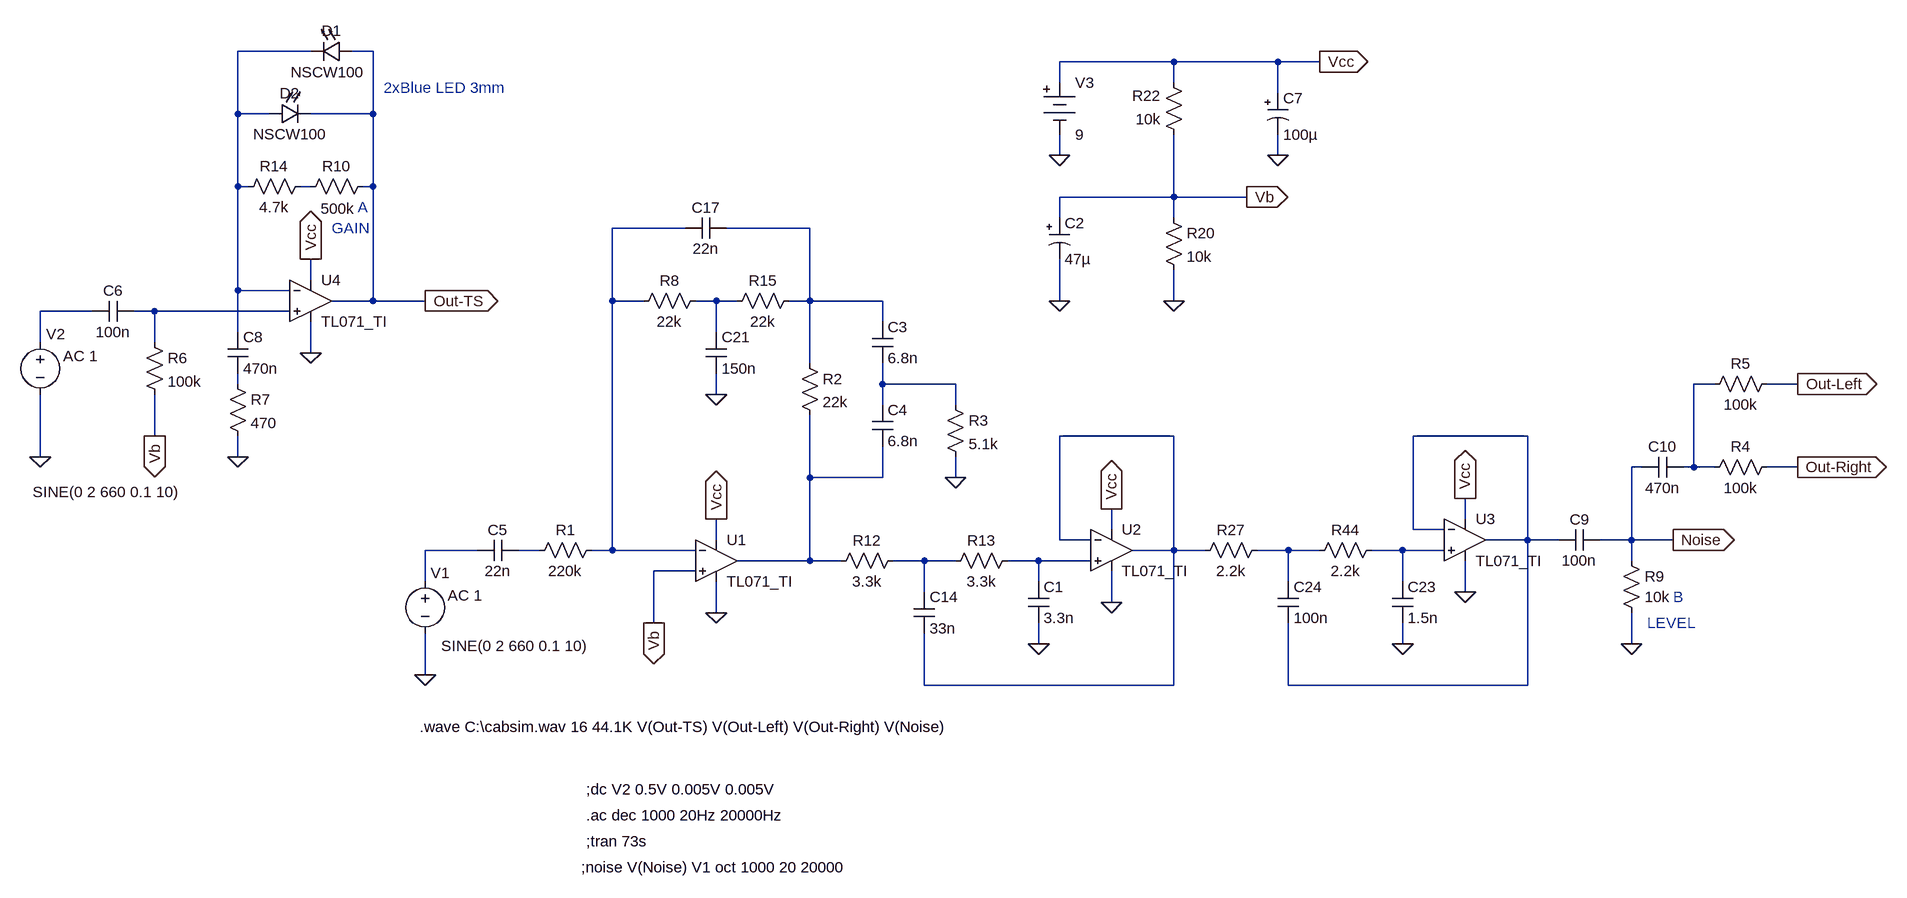
[diagram p0: schematic MB 4x12 V30 Cabinet Simulator.asc]
MB 4x12 V30 Cabinet Simulator.asc, the LTspice schematic file:
Version 4
SHEET 1 2020 1684
WIRE -4080 -624 -4192 -624
WIRE -3984 -624 -4016 -624
WIRE -2752 -608 -2928 -608
WIRE -2592 -608 -2752 -608
WIRE -2528 -608 -2592 -608
WIRE -2928 -576 -2928 -608
WIRE -2752 -576 -2752 -608
WIRE -2592 -560 -2592 -608
WIRE -4192 -528 -4192 -624
WIRE -4144 -528 -4192 -528
WIRE -3984 -528 -3984 -624
WIRE -3984 -528 -4080 -528
WIRE -2928 -464 -2928 -496
WIRE -2592 -464 -2592 -496
WIRE -4192 -416 -4192 -528
WIRE -4176 -416 -4192 -416
WIRE -4080 -416 -4096 -416
WIRE -3984 -416 -3984 -528
WIRE -3984 -416 -4000 -416
WIRE -2752 -400 -2752 -496
WIRE -2752 -400 -2928 -400
WIRE -2640 -400 -2752 -400
WIRE -2928 -368 -2928 -400
WIRE -2752 -368 -2752 -400
WIRE -3504 -352 -3616 -352
WIRE -3312 -352 -3440 -352
WIRE -4080 -272 -4080 -304
WIRE -4192 -256 -4192 -416
WIRE -4112 -256 -4192 -256
WIRE -3984 -240 -3984 -416
WIRE -3984 -240 -4048 -240
WIRE -3904 -240 -3984 -240
WIRE -3616 -240 -3616 -352
WIRE -3568 -240 -3616 -240
WIRE -3456 -240 -3488 -240
WIRE -3424 -240 -3456 -240
WIRE -3312 -240 -3312 -352
WIRE -3312 -240 -3344 -240
WIRE -3200 -240 -3312 -240
WIRE -2928 -240 -2928 -304
WIRE -2752 -240 -2752 -288
WIRE -4416 -224 -4496 -224
WIRE -4320 -224 -4352 -224
WIRE -4112 -224 -4320 -224
WIRE -3200 -208 -3200 -240
WIRE -4192 -192 -4192 -256
WIRE -3456 -192 -3456 -240
WIRE -4496 -176 -4496 -224
WIRE -4320 -176 -4320 -224
WIRE -4080 -160 -4080 -208
WIRE -3312 -144 -3312 -240
WIRE -4192 -112 -4192 -128
WIRE -3200 -112 -3200 -144
WIRE -3088 -112 -3200 -112
WIRE -1920 -112 -1952 -112
WIRE -1792 -112 -1840 -112
WIRE -3456 -96 -3456 -128
WIRE -3200 -80 -3200 -112
WIRE -3088 -80 -3088 -112
WIRE -4320 -32 -4320 -96
WIRE -2752 -32 -2928 -32
WIRE -2208 -32 -2384 -32
WIRE -4496 0 -4496 -96
WIRE -4192 0 -4192 -32
WIRE -2032 16 -2048 16
WIRE -1952 16 -1952 -112
WIRE -1952 16 -1968 16
WIRE -1920 16 -1952 16
WIRE -1792 16 -1840 16
WIRE -3312 32 -3312 -64
WIRE -3200 32 -3200 -16
WIRE -3200 32 -3312 32
WIRE -3088 32 -3088 0
WIRE -2304 96 -2304 64
WIRE -2848 112 -2848 80
WIRE -2384 112 -2384 -32
WIRE -2336 112 -2384 112
WIRE -3456 128 -3456 96
WIRE -2928 128 -2928 -32
WIRE -2880 128 -2928 128
WIRE -2208 128 -2208 -32
WIRE -2208 128 -2272 128
WIRE -2160 128 -2208 128
WIRE -2048 128 -2048 16
WIRE -2048 128 -2096 128
WIRE -1984 128 -2048 128
WIRE -3824 144 -3904 144
WIRE -3728 144 -3760 144
WIRE -3616 144 -3616 -240
WIRE -3616 144 -3648 144
WIRE -3488 144 -3616 144
WIRE -2752 144 -2752 -32
WIRE -2752 144 -2816 144
WIRE -2704 144 -2752 144
WIRE -2576 144 -2624 144
WIRE -2528 144 -2576 144
WIRE -2400 144 -2448 144
WIRE -2336 144 -2400 144
WIRE -3312 160 -3312 32
WIRE -3312 160 -3424 160
WIRE -3264 160 -3312 160
WIRE -3136 160 -3184 160
WIRE -3088 160 -3136 160
WIRE -2960 160 -3008 160
WIRE -2880 160 -2960 160
WIRE -2048 160 -2048 128
WIRE -3488 176 -3552 176
WIRE -3904 192 -3904 144
WIRE -2960 192 -2960 160
WIRE -2576 192 -2576 144
WIRE -2400 192 -2400 144
WIRE -3136 208 -3136 160
WIRE -2304 208 -2304 160
WIRE -2848 224 -2848 176
WIRE -3456 240 -3456 192
WIRE -3552 256 -3552 176
WIRE -2960 288 -2960 256
WIRE -2400 288 -2400 256
WIRE -2048 288 -2048 240
WIRE -3904 336 -3904 272
WIRE -3136 352 -3136 272
WIRE -2752 352 -2752 144
WIRE -2752 352 -3136 352
WIRE -2576 352 -2576 256
WIRE -2208 352 -2208 128
WIRE -2208 352 -2576 352
FLAG -2928 -464 0
FLAG -2752 -240 0
FLAG -2640 -400 Vb
IOPIN -2640 -400 Out
FLAG -2528 -608 Vcc
IOPIN -2528 -608 Out
FLAG -2400 288 0
FLAG -2304 208 0
FLAG -2304 64 Vcc
IOPIN -2304 64 Out
FLAG -3456 240 0
FLAG -3456 96 Vcc
IOPIN -3456 96 Out
FLAG -3552 256 Vb
IOPIN -3552 256 Out
FLAG -2848 80 Vcc
IOPIN -2848 80 Out
FLAG -2848 224 0
FLAG -2048 288 0
FLAG -2592 -464 0
FLAG -3456 -96 0
FLAG -2928 -240 0
FLAG -2960 288 0
FLAG -1984 128 Noise
IOPIN -1984 128 Out
FLAG -3904 336 0
FLAG -3088 32 0
FLAG -1792 -112 Out-Left
IOPIN -1792 -112 Out
FLAG -1792 16 Out-Right
IOPIN -1792 16 Out
FLAG -4080 -160 0
FLAG -4080 -304 Vcc
IOPIN -4080 -304 Out
FLAG -4192 0 0
FLAG -4320 -32 Vb
IOPIN -4320 -32 Out
FLAG -4496 0 0
FLAG -3904 -240 Out-TS
IOPIN -3904 -240 Out
SYMBOL res -2768 -384 R0
SYMATTR InstName R20
SYMATTR Value 10k
SYMBOL res -2736 -480 R180
WINDOW 0 36 76 Left 2
WINDOW 3 36 40 Left 2
SYMATTR InstName R22
SYMATTR Value 10k
SYMBOL Misc\\battery -2928 -592 R0
WINDOW 123 0 0 Left 2
WINDOW 39 0 0 Left 2
SYMATTR InstName V3
SYMATTR Value 9
SYMBOL polcap -2944 -368 R0
WINDOW 3 24 64 Left 2
SYMATTR Value 47µ
SYMATTR InstName C2
SYMATTR Description Capacitor
SYMATTR Type cap
SYMATTR SpiceLine V=25 Irms=60m Rser=2.4 Lser=0
SYMBOL res -2608 128 R90
WINDOW 0 0 56 VBottom 2
WINDOW 3 32 56 VTop 2
SYMATTR InstName R27
SYMATTR Value 2.2k
SYMBOL cap -2416 192 R0
SYMATTR InstName C23
SYMATTR Value 1.5n
SYMBOL res -2432 128 R90
WINDOW 0 0 56 VBottom 2
WINDOW 3 32 56 VTop 2
SYMATTR InstName R44
SYMATTR Value 2.2k
SYMBOL cap -2592 192 R0
SYMATTR InstName C24
SYMATTR Value 100n
SYMBOL cap -3760 128 R90
WINDOW 0 0 32 VBottom 2
WINDOW 3 32 32 VTop 2
SYMATTR InstName C5
SYMATTR Value 22n
SYMATTR SpiceLine V=16 Irms=0 Rser=0.007 Lser=0
SYMBOL res -3168 144 R90
WINDOW 0 0 56 VBottom 2
WINDOW 3 32 56 VTop 2
SYMATTR InstName R12
SYMATTR Value 3.3k
SYMBOL res -2992 144 R90
WINDOW 0 0 56 VBottom 2
WINDOW 3 32 56 VTop 2
SYMATTR InstName R13
SYMATTR Value 3.3k
SYMBOL cap -3152 208 R0
SYMATTR InstName C14
SYMATTR Value 33n
SYMBOL cap -3440 -368 R90
WINDOW 0 0 32 VBottom 2
WINDOW 3 32 32 VTop 2
SYMATTR InstName C17
SYMATTR Value 22n
SYMBOL res -2064 144 R0
WINDOW 3 36 72 Left 2
SYMATTR Value 10k
SYMATTR InstName R9
SYMBOL polcap -2608 -560 R0
WINDOW 3 24 64 Left 2
SYMATTR Value 100µ
SYMATTR InstName C7
SYMATTR Description Capacitor
SYMATTR Type cap
SYMATTR SpiceLine V=2.5 Irms=1.1 Rser=0.07 Lser=0
SYMBOL res -3472 -256 R90
WINDOW 0 0 56 VBottom 2
WINDOW 3 32 56 VTop 2
SYMATTR InstName R8
SYMATTR Value 22k
SYMBOL res -3328 -256 R90
WINDOW 0 0 56 VBottom 2
WINDOW 3 32 56 VTop 2
SYMATTR InstName R15
SYMATTR Value 22k
SYMBOL cap -3472 -192 R0
SYMATTR InstName C21
SYMATTR Value 150n
SYMATTR SpiceLine V=10 Irms=0 Rser=0.009 Lser=0
SYMBOL cap -2096 112 R90
WINDOW 0 0 32 VBottom 2
WINDOW 3 32 32 VTop 2
SYMATTR InstName C9
SYMATTR Value 100n
SYMBOL EXTRA\\AudioOpamp\\TI\\TL071_TI -3456 160 R0
SYMATTR InstName U1
SYMBOL EXTRA\\AudioOpamp\\TI\\TL071_TI -2848 144 R0
SYMATTR InstName U2
SYMBOL EXTRA\\AudioOpamp\\TI\\TL071_TI -2304 128 R0
SYMATTR InstName U3
SYMBOL res -3632 128 R90
WINDOW 0 0 56 VBottom 2
WINDOW 3 32 56 VTop 2
SYMATTR InstName R1
SYMATTR Value 220k
SYMBOL cap -2976 192 R0
SYMATTR InstName C1
SYMATTR Value 3.3n
SYMBOL voltage -3904 176 R0
WINDOW 123 35 37 Left 2
WINDOW 39 0 0 Left 2
WINDOW 3 25 115 Left 2
WINDOW 0 9 3 Left 2
SYMATTR Value2 AC 1
SYMATTR Value SINE(0 2 660 0.1 10)
SYMATTR InstName V1
SYMBOL res -3328 -160 R0
SYMATTR InstName R2
SYMATTR Value 22k
SYMBOL cap -3216 -208 R0
SYMATTR InstName C3
SYMATTR Value 6.8n
SYMBOL cap -3216 -80 R0
SYMATTR InstName C4
SYMATTR Value 6.8n
SYMBOL res -3104 -96 R0
SYMATTR InstName R3
SYMATTR Value 5.1k
SYMBOL res -1824 0 R90
WINDOW 0 0 56 VBottom 2
WINDOW 3 32 56 VTop 2
SYMATTR InstName R4
SYMATTR Value 100k
SYMBOL res -1824 -128 R90
WINDOW 0 0 56 VBottom 2
WINDOW 3 32 56 VTop 2
SYMATTR InstName R5
SYMATTR Value 100k
SYMBOL cap -4352 -240 R90
WINDOW 0 0 32 VBottom 2
WINDOW 3 32 32 VTop 2
SYMATTR InstName C6
SYMATTR Value 100n
SYMATTR SpiceLine V=16 Irms=0 Rser=0.007 Lser=0
SYMBOL res -4336 -192 R0
SYMATTR InstName R6
SYMATTR Value 100k
SYMBOL EXTRA\\AudioOpamp\\TI\\TL071_TI -4080 -240 R0
SYMATTR InstName U4
SYMBOL res -4208 -128 R0
SYMATTR InstName R7
SYMATTR Value 470
SYMBOL res -3984 -432 R90
WINDOW 0 0 56 VBottom 2
WINDOW 3 34 54 VTop 2
SYMATTR InstName R10
SYMATTR Value 500k
SYMBOL cap -4208 -192 R0
SYMATTR InstName C8
SYMATTR Value 470n
SYMATTR SpiceLine V=16 Irms=0 Rser=0.007 Lser=0
SYMBOL LED -4016 -640 R90
WINDOW 0 0 32 VBottom 2
WINDOW 3 32 38 VTop 2
SYMATTR InstName D1
SYMATTR Value NSCW100
SYMATTR Description Diode
SYMATTR Type diode
SYMBOL LED -4144 -544 M90
WINDOW 0 0 32 VBottom 2
WINDOW 3 32 32 VTop 2
SYMATTR InstName D2
SYMATTR Value NSCW100
SYMATTR Description Diode
SYMATTR Type diode
SYMBOL res -4080 -432 R90
WINDOW 0 0 56 VBottom 2
WINDOW 3 32 56 VTop 2
SYMATTR InstName R14
SYMATTR Value 4.7k
SYMBOL voltage -4496 -192 R0
WINDOW 123 35 37 Left 2
WINDOW 39 0 0 Left 2
WINDOW 3 -12 246 Left 2
WINDOW 0 9 3 Left 2
SYMATTR Value2 AC 1
SYMATTR Value SINE(0 2 660 0.1 10)
SYMATTR InstName V2
SYMBOL cap -1968 0 R90
WINDOW 0 0 32 VBottom 2
WINDOW 3 32 32 VTop 2
SYMATTR InstName C10
SYMATTR Value 470n
TEXT -3656 592 Left 2 !;tran 73s
TEXT -3656 512 Left 2 !;dc V2 0.5V 0.005V 0.005V
TEXT -3656 552 Left 2 !.ac dec 1000 20Hz 20000Hz
TEXT -3912 416 Left 2 !.wave C:\\cabsim.wav 16 44.1K V(Out-TS) V(Out-Left) V(Out-Right) V(Noise)
TEXT -3664 632 Left 2 !;noise V(Noise) V1 oct 1000 20 20000
TEXT -4048 -352 Left 2 ;GAIN
TEXT -4008 -384 Left 2 ;A
TEXT -3968 -568 Left 2 ;2xBlue LED 3mm
TEXT -2024 256 Left 2 ;LEVEL
TEXT -1984 216 Left 2 ;B

The netlist it stands for:
* MB 4x12 V30 Cabinet Simulator.asc
R20 Vb 0 10k
R22 Vb Vcc 10k
V3 Vcc 0 9
C2 Vb 0 47µ V=25 Irms=60m Rser=2.4 Lser=0
R27 N016 N011 2.2k
C23 N017 0 1.5n
R44 N017 N016 2.2k
C24 N016 N012 100n
C5 N015 N014 22n V=16 Irms=0 Rser=0.007 Lser=0
R12 N018 N013 3.3k
R13 N019 N018 3.3k
C14 N018 N011 33n
C17 N004 N003 22n
R9 Noise 0 10k
C7 Vcc 0 100µ V=2.5 Irms=1.1 Rser=0.07 Lser=0
R8 N005 N003 22k
R15 N004 N005 22k
C21 N005 0 150n V=10 Irms=0 Rser=0.009 Lser=0
C9 Noise N012 100n
* U1: TL071_TI (symbol EXTRA\AudioOpamp\TI\TL071_TI not available, pins judged from their places): In+=Vb In-=N003 V+=Vcc V-=0 OUT=N013
* U2: TL071_TI (symbol EXTRA\AudioOpamp\TI\TL071_TI not available, pins judged from their places): In+=N019 In-=N011 V+=Vcc V-=0 OUT=N011
* U3: TL071_TI (symbol EXTRA\AudioOpamp\TI\TL071_TI not available, pins judged from their places): In+=N017 In-=N012 V+=Vcc V-=0 OUT=N012
R1 N003 N015 220k
C1 N019 0 3.3n
V1 N014 0 SINE(0 2 660 0.1 10) AC 1
R2 N004 N013 22k
C3 N004 N009 6.8n
C4 N009 N013 6.8n
R3 N009 0 5.1k
R4 Out-Right N010 100k
R5 Out-Left N010 100k
C6 N007 N006 100n V=16 Irms=0 Rser=0.007 Lser=0
R6 N007 Vb 100k
* U4: TL071_TI (symbol EXTRA\AudioOpamp\TI\TL071_TI not available, pins judged from their places): In+=N007 In-=N001 V+=Vcc V-=0 OUT=Out-TS
R7 N008 0 470
R10 Out-TS N002 500k
C8 N001 N008 470n V=16 Irms=0 Rser=0.007 Lser=0
D1 Out-TS N001 NSCW100
D2 N001 Out-TS NSCW100
R14 N002 N001 4.7k
V2 N006 0 SINE(0 2 660 0.1 10) AC 1
C10 N010 Noise 470n
.model D D
.lib standard.dio
;tran 73s
;dc V2 0.5V 0.005V 0.005V
.ac dec 1000 20Hz 20000Hz
.wave C:\cabsim.wav 16 44.1K V(Out-TS) V(Out-Left) V(Out-Right) V(Noise)
;noise V(Noise) V1 oct 1000 20 20000
* GAIN
* A
* 2xBlue LED 3mm
* LEVEL
* B
.backanno
.end